# EAGLE schematic 216_matrix (EAGLE 7.4.0)
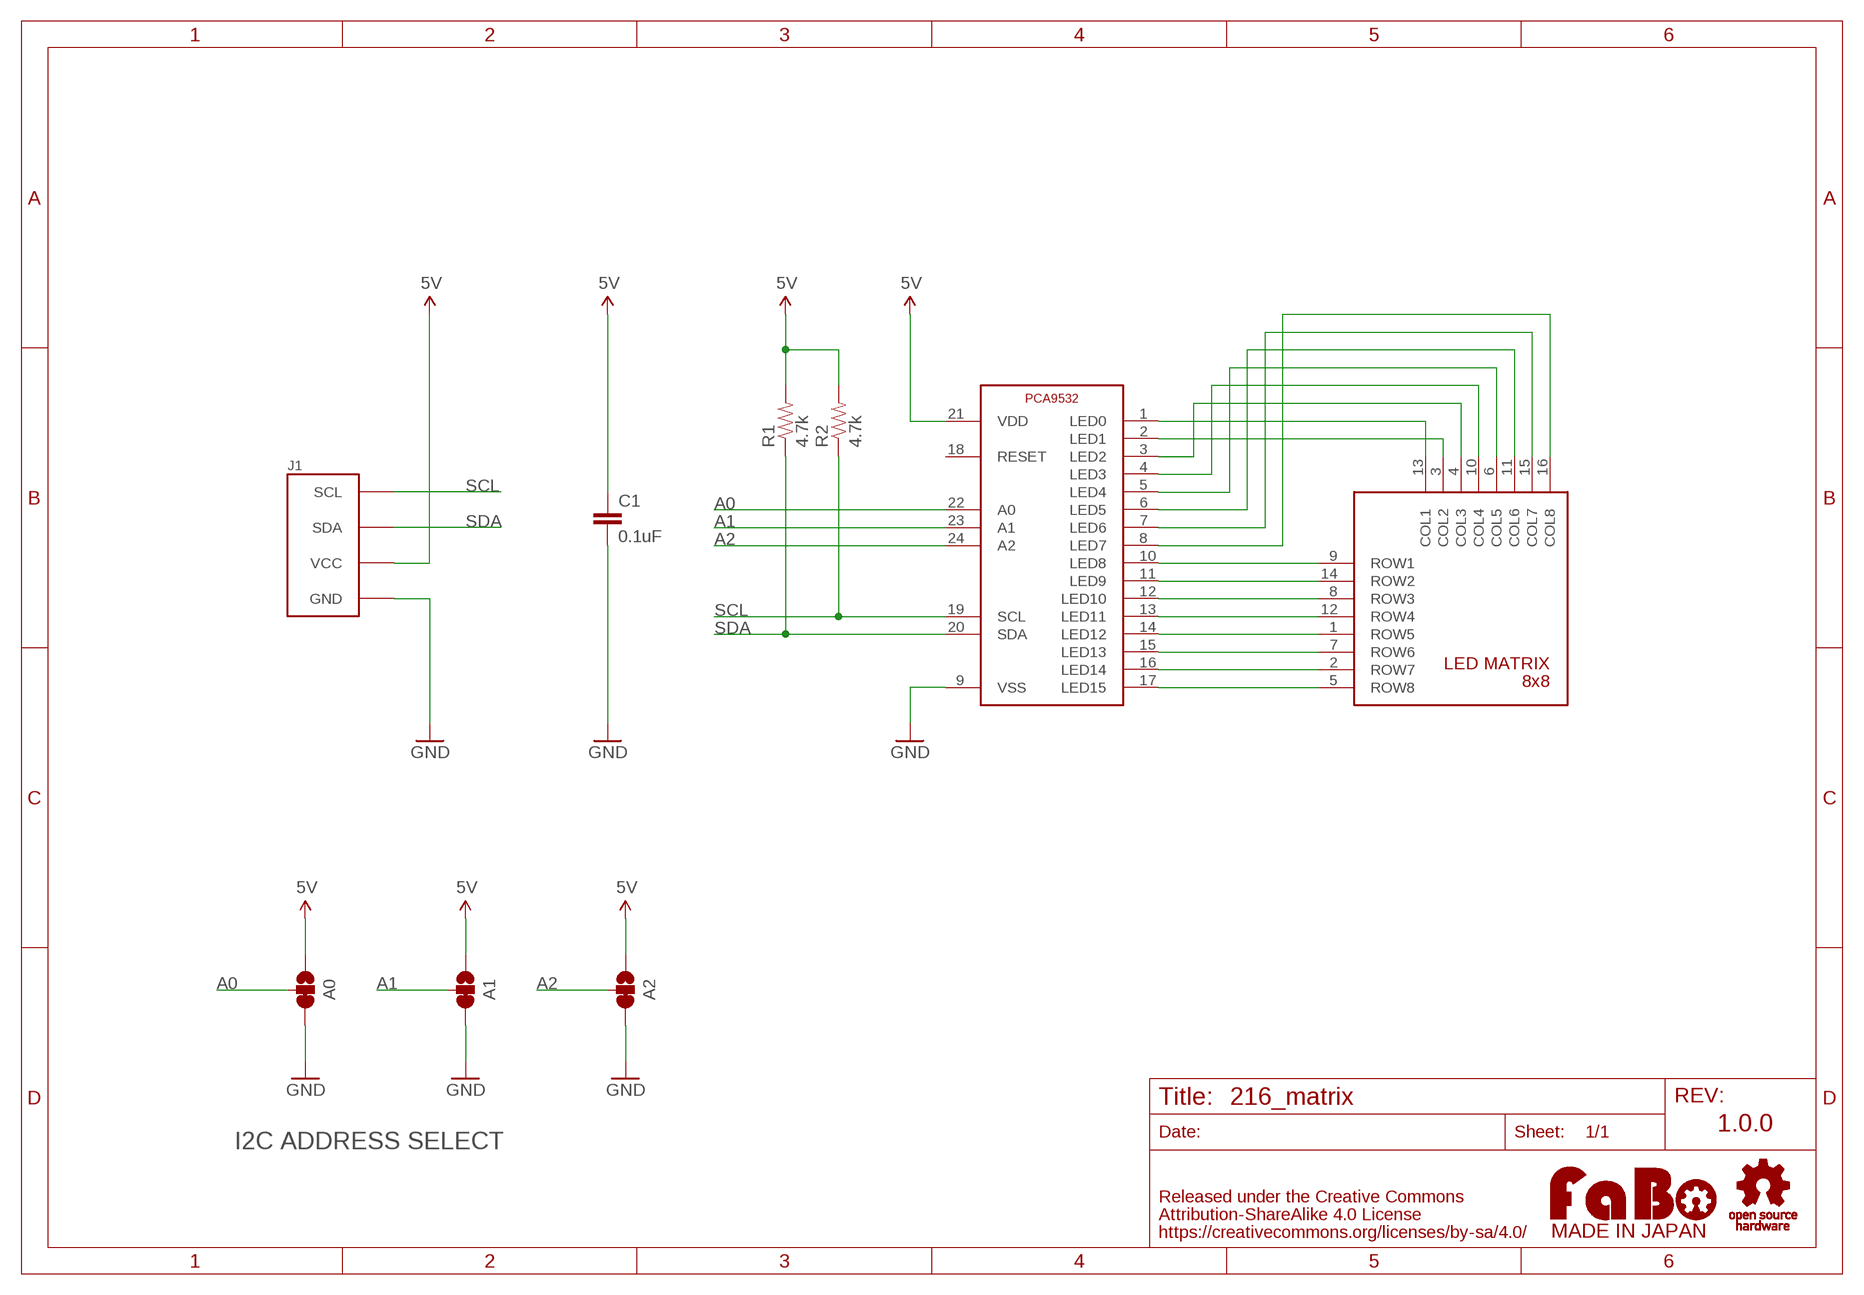
[diagram p0: schematic, sheet 1]

## Parts
A0  SMD-JUMPER-3-23SHORT  [SMD-JUMPER-3]
A1  SMD-JUMPER-3-23SHORT  [SMD-JUMPER-3]
A2  SMD-JUMPER-3-23SHORT  [SMD-JUMPER-3]
C1  0.1uF  CAP-EIA0603  [EIA0603]
IC1  PCA9532BS  [HVQFN24]
J1  FABO_BRICK_I2C  [FABO_BRICK_I2C]
R1  4.7k  RES-EIA0603  [EIA0603]
R2  4.7k  RES-EIA0603  [EIA0603]
U1  MATRIX_8X8_A_COM  [GYXM-788ASR]
U$2  LOGO_OSHW-T_M_BOTTOM  [LOGO_OSHW_T_MS_BOTTOM]
U$3  LOGO_FABO-S  [LOGO_FABO_S]

## Nets
5V: A0.1 A1.1 A2.1 C1.1 IC1.21(VDD) J1.VCC R1.2 R2.2
A0: A0.2 IC1.22(A0)
A1: A1.2 IC1.23(A1)
A2: A2.2 IC1.24(A2)
GND: A0.3 A1.3 A2.3 C1.2 IC1.9(VSS) J1.GND
N$8: IC1.1(LED0) U1.13(COL1)
N$9: IC1.2(LED1) U1.3(COL2)
N$10: IC1.3(LED2) U1.4(COL3)
N$11: IC1.4(LED3) U1.10(COL4)
N$12: IC1.5(LED4) U1.6(COL5)
N$13: IC1.6(LED5) U1.11(COL6)
N$14: IC1.7(LED6) U1.15(COL7)
N$15: IC1.8(LED7) U1.16(COL8)
N$16: IC1.10(LED8) U1.9(ROW1)
N$17: IC1.11(LED9) U1.14(ROW2)
N$18: IC1.12(LED10) U1.8(ROW3)
N$19: IC1.13(LED11) U1.12(ROW4)
N$20: IC1.14(LED12) U1.1(ROW5)
N$21: IC1.15(LED13) U1.7(ROW6)
N$22: IC1.16(LED14) U1.2(ROW7)
N$23: IC1.17(LED15) U1.5(ROW8)
SCL: IC1.19(SCL) J1.SCL R2.1
SDA: IC1.20(SDA) J1.SDA R1.1
Unconnected: IC1.18(RESET)

## Notes on the sheet
- 1.0.0
- I2C ADDRESS SELECT

## Library data of the parts
A0 A1 A2 = FaBo-etc:SMD-JUMPER-3-23SHORT
C1 = FaBo-etc:CAP: Capacitor Standard 0603 ceramic capacitor
IC1 = FaBo-etc:PCA9532
J1 = FaBo-Template:FABO_BRICK_I2C: FaBo Brick I2C
R1 R2 = FaBo-etc:RES
U1 = FaBo-LED:MATRIX_8X8_A_COM
U$2 = FaBo-etc:LOGO_OSHW
U$3 = FaBo-etc:LOGO_FABO